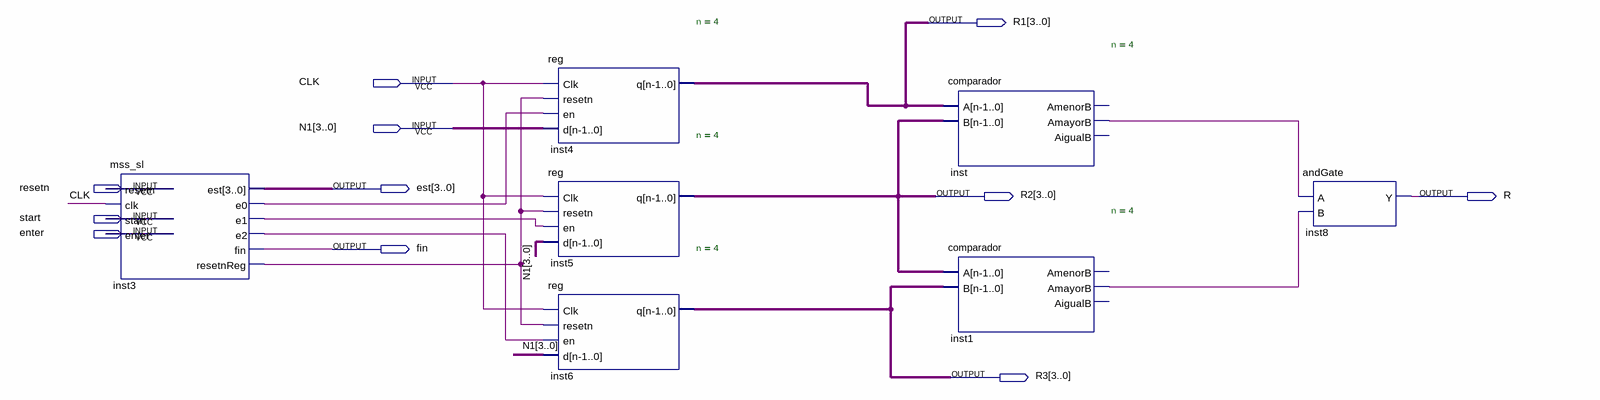
[diagram p0: schematic sheet]
// Quartus schematic Bloques.bdf as structural Verilog: 7 symbols, 11 pins
module Bloques (
  input  CLK,
  input  [3:0] N1,
  input  resetn,
  input  start,
  input  enter,
  output [3:0] R1,
  output [3:0] est,
  output [3:0] R2,
  output R,
  output fin,
  output [3:0] R3
);

  wire inst1_amayorb, inst3_e0, inst3_e1, inst3_e2, inst3_resetnreg, inst_amayorb;

  mss_sl inst3 (
    .resetn(resetn), .clk(CLK), .start(start), .enter(enter), .est(est), .e0(inst3_e0), .e1(inst3_e1),
    .e2(inst3_e2), .fin(fin), .resetnReg(inst3_resetnreg));
  \reg  #(.n(4)) inst4 (.Clk(CLK), .resetn(inst3_resetnreg), .en(inst3_e0), .d(N1), .q(R1));
  \reg  #(.n(4)) inst5 (.Clk(CLK), .resetn(inst3_resetnreg), .en(inst3_e1), .d(N1), .q(R2));
  \reg  #(.n(4)) inst6 (.Clk(CLK), .resetn(inst3_resetnreg), .en(inst3_e2), .d(N1), .q(R3));
  comparador #(.n(4)) inst (.A(R1), .B(R2), .AmayorB(inst_amayorb));  // open: AmenorB, AigualB
  comparador #(.n(4)) inst1 (.A(R2), .B(R3), .AmayorB(inst1_amayorb));  // open: AmenorB, AigualB
  andGate inst8 (.A(inst_amayorb), .B(inst1_amayorb), .Y(R));
endmodule
